# EAGLE design fernsteuerung (EAGLE 9.4.1)
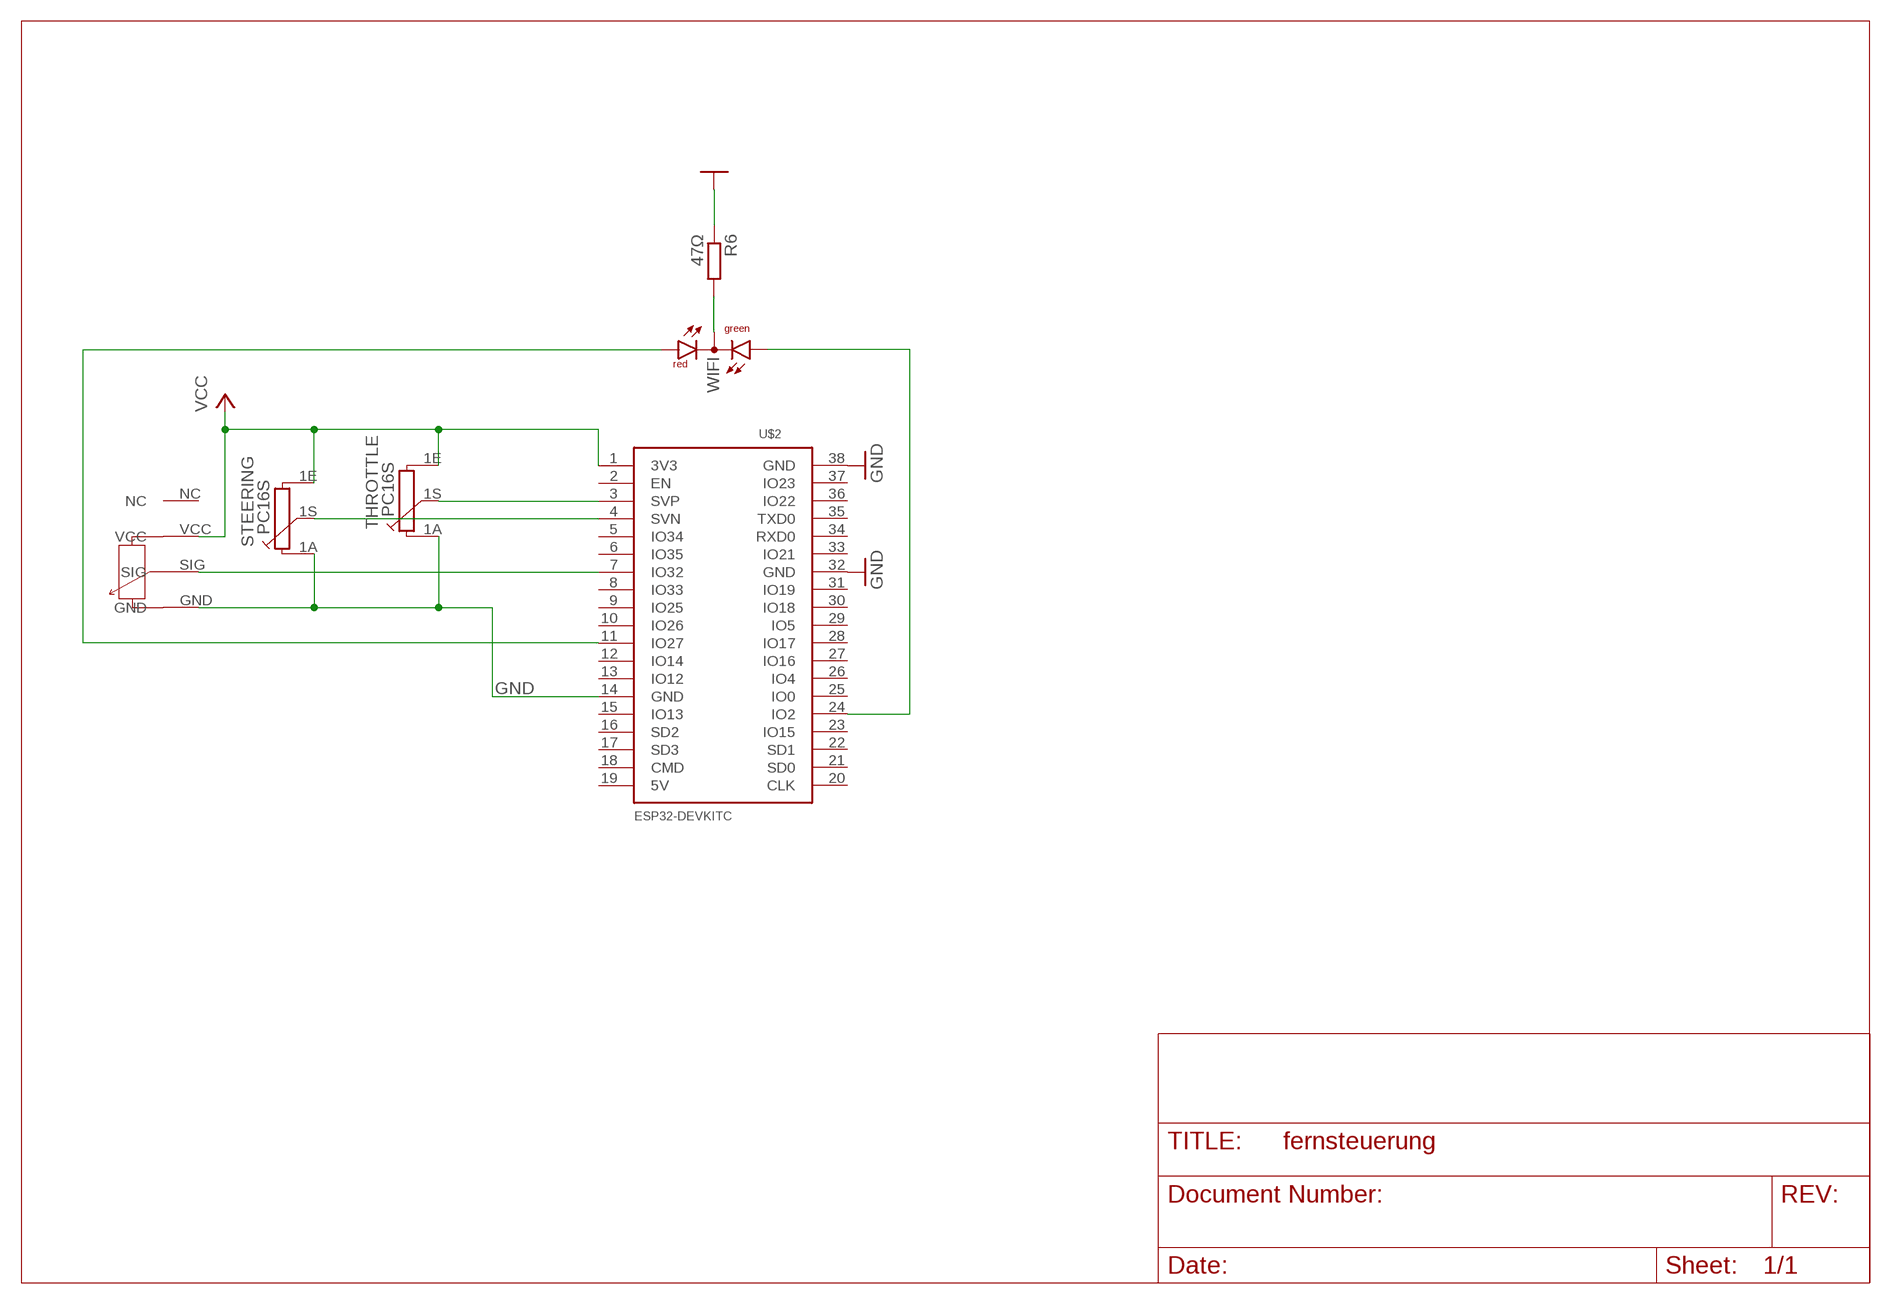
[diagram p0: schematic, sheet 1]

## Parts
R6  47Ω  R-EU_R0603  [R0603]
STEERING  PC16S  [PC16S]
THROTTLE  PC16S  [PC16S]
TRIM  ALPS_RK11K  [ALPS_RK11K]
U$2  ESP32DEVKITC  [ESP32-DEVKITC]
WIFI  DUOLED-RG-C3MM  [DUOLED-A-3MM]

## Nets
GND: R6.1 STEERING.1A THROTTLE.1A TRIM.GND U$2.14(GND) U$2.32(GND) U$2.38(GND)
N$1: U$2.11(IO27) WIFI.3(AR)
N$2: TRIM.SIG U$2.7(IO32)
N$3: STEERING.1S U$2.4(SVN)
N$4: THROTTLE.1S U$2.3(SVP)
N$5: R6.2 WIFI.2(C)
VCC: STEERING.1E THROTTLE.1E TRIM.VCC U$2.1(3V3)
WIFI_STATUS: U$2.24(IO2) WIFI.1(AG)
Unconnected: TRIM.NC U$2.2(EN) U$2.5(IO34) U$2.6(IO35) U$2.8(IO33) U$2.9(IO25) U$2.10(IO26) U$2.12(IO14) U$2.13(IO12) U$2.15(IO13) U$2.16(SD2) U$2.17(SD3) U$2.18(CMD) U$2.19(5V) U$2.20(CLK) U$2.21(SD0) U$2.22(SD1) U$2.23(IO15) U$2.25(IO0) U$2.26(IO4) U$2.27(IO16) U$2.28(IO17) U$2.29(IO5) U$2.30(IO18) U$2.31(IO19) U$2.33(IO21) U$2.34(RXD0) U$2.35(TXD0) U$2.36(IO22) U$2.37(IO23)

## Library data of the parts
R6 = rcl:R-EU_: RESISTOR, European symbol; SPICEPREFIX: R
STEERING THROTTLE = piher:PC16S: POTENTIOMETER single carbon potentiometer, 16 mm, S3ROH; OC_FARNELL: 4452940; OC_NEWARK: unknown
TRIM = ALPS_RK11K:ALPS_RK11K
U$2 = ESP32-DEVKITC:ESP32DEVKITC
WIFI = led2:DUOLED-RG-C: DUO LED 2 colors (red/green), 5 mm, round, common Cathode www.ligitek.com or other producers.

## Board
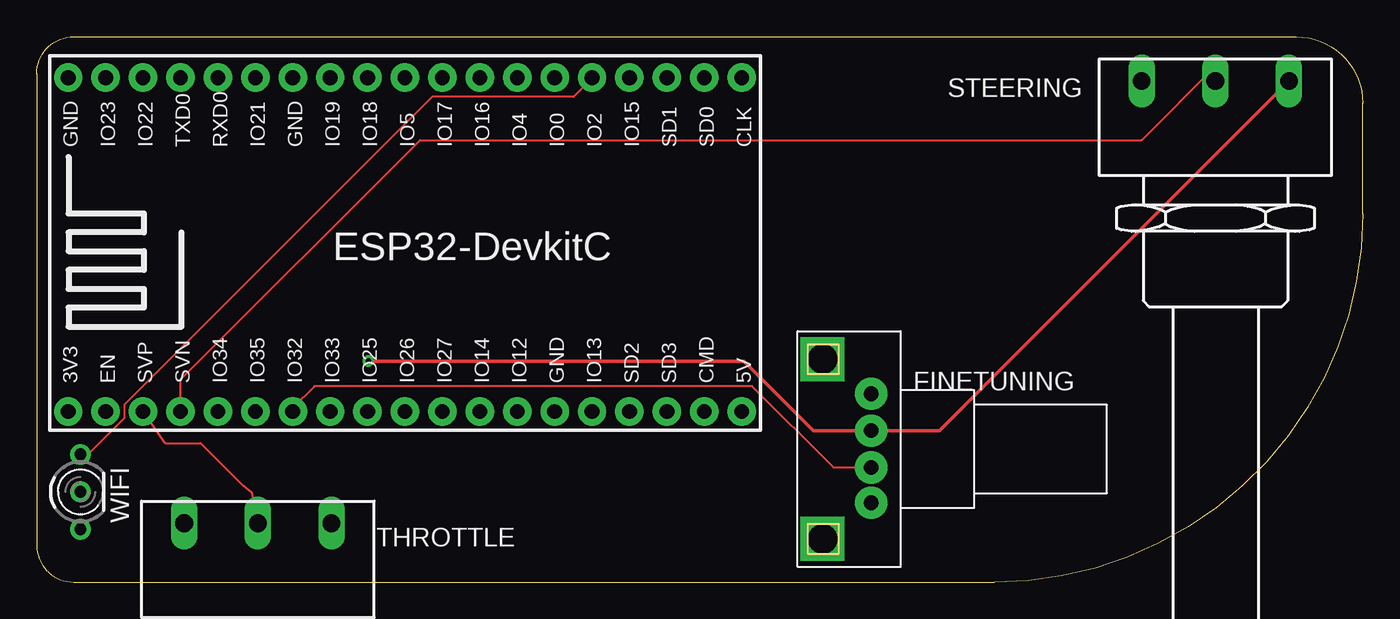
[diagram p1: board, top side]
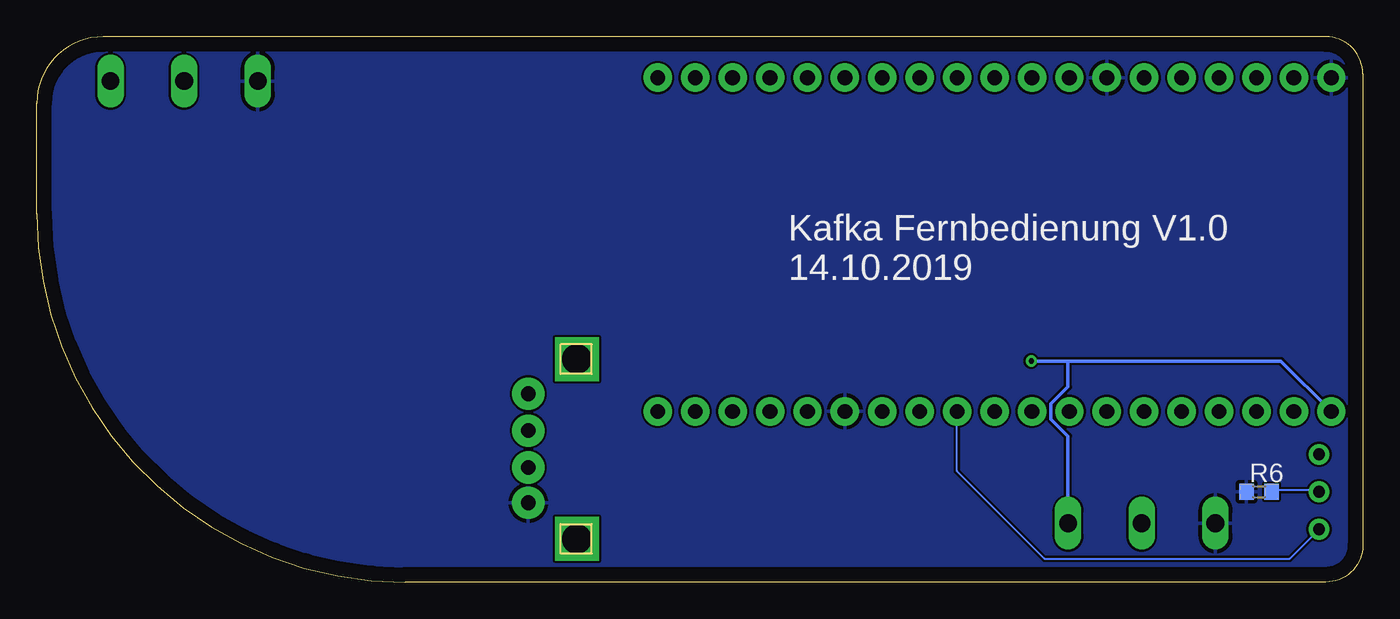
[diagram p2: board, bottom side, seen from below]

Size 90 x 37 mm. Coordinates in mm from the lower left corner, seen from the top.
Outline: 2.5,0 65,0 arc90 90,25 90,32.5 arc90 85.5,37 2.5,37 arc90 0,34.5 0,2.5 arc90 2.5,0
Copper layers (1*16): Top 0.035mm / dielectric 1.5mm / Bottom 0.035mm
Design rules "default": minimum track width 6mil, minimum drill 0.35mm, track to track 6mil, track to pad 6mil, pad to pad 6mil, via to via 6mil, smd to smd 6mil, copper to edge 40mil, drill to drill 6mil, minimum pad ring 10mil, minimum via ring 8mil, stop-mask expansion 4mil, vias tented up to drill 0mil, thermal gap 10mil

### Footprints (pad centres in the part's own frame; a part is rotated, then mirrored left to right if it is on the bottom)
R0603 = smd 1 x 1.1: 1 -0.85,0; 2 0.85,0
PC16S = drill 1.2 long: 1A -5,6.5; 1E 5,6.5; 1S 0,6.5
ALPS_RK11K = drill 1 pad 2.184: GND -3.65,0; NC 3.75,0; SIG -1.25,0; VCC 1.25,0 | drill 2 square: P$1 -6.096,3.302; P$2 6.096,3.302
ESP32-DEVKITC = drill 1 pad 1.93: 1 -22.87,-11.42; 2 -20.33,-11.42; 3 -17.79,-11.42; 4 -15.25,-11.42; 5 -12.71,-11.42; 6 -10.17,-11.42; 7 -7.63,-11.42; 8 -5.09,-11.42; 9 -2.55,-11.42; 10 -0.01,-11.42; 11 2.53,-11.42; 12 5.07,-11.42; 13 7.61,-11.42; 14 10.15,-11.42; 15 12.69,-11.42; 16 15.23,-11.42; 17 17.77,-11.42; 18 20.31,-11.42; 19 22.85,-11.42; 20 22.85,11.23; 21 20.31,11.23; 22 17.77,11.23; 23 15.23,11.23; 24 12.69,11.23; 25 10.15,11.23; 26 7.61,11.23; 27 5.07,11.23; 28 2.53,11.23; 29 -0.01,11.23; 30 -2.55,11.23; 31 -5.09,11.23; 32 -7.63,11.23; 33 -10.17,11.23; 34 -12.71,11.23; 35 -15.25,11.23; 36 -17.79,11.23; 37 -20.33,11.23; 38 -22.87,11.23
DUOLED-A-3MM = drill 0.8 pad 1.4: 1 -2.54,0; 2 0,0; 3 2.54,0

### Placement (x,y rotation side)
R6  7.04,6.13 0 bottom
STEERING  80,27.5 0 top
THROTTLE  15,-2.5 0 top
TRIM  56.64,9.03 90 top
U$2  25,23 0 top
WIFI  2.96,6.13 270 top

### Tracks (layer width: path | path; a pad name or v marks a point on that pad's centre or on a via)
GND
  pour Bottom: 0,0 0,40 90,40 90,0
N$1
  Bottom 0.152: WIFI.3 4.96,1.59 21.59,1.59 27.53,7.53 U$2.11
N$2
  Top 0.152: U$2.7 17.37,11.82 18.86,13.3 48.55,13.3 54.08,7.78 TRIM.SIG
N$3
  Top 0.152: STEERING.1S 80,35 75,30 30,30 26,30 9.75,13.75 U$2.4
N$4
  Top 0.152: THROTTLE.1S 14.59,6.07 14,6.55 11.12,9.43 8.72,9.43 U$2.3
N$5
  Bottom 0.152: R6.2 6.1,6.25 3.05,6.25 WIFI.2
VCC  (via drill 0.35)
  Top 0.254: STEERING.1E 61.28,10.28 TRIM.VCC 52.72,10.28 48,15 v22.5,15
  Bottom 0.254: U$2.1 5.55,15 20,15 | 20,15 20,13.25 21.16,12.1 21.16,11.06 20,9.91 THROTTLE.1E | 20,15 v22.5,15
WIFI_STATUS
  Top 0.152: WIFI.1 3.05,8.69 3.5,8.69 5.94,11.12 5.94,12.04 26.82,32.92 36.42,32.92 37.64,34.14 U$2.24

### Text on the board
tNames: FINETUNING
bNames: Kafka Fernbedienung V1.0 / 14.10.2019